# EAGLE design speedometer (EAGLE 9.3.2)
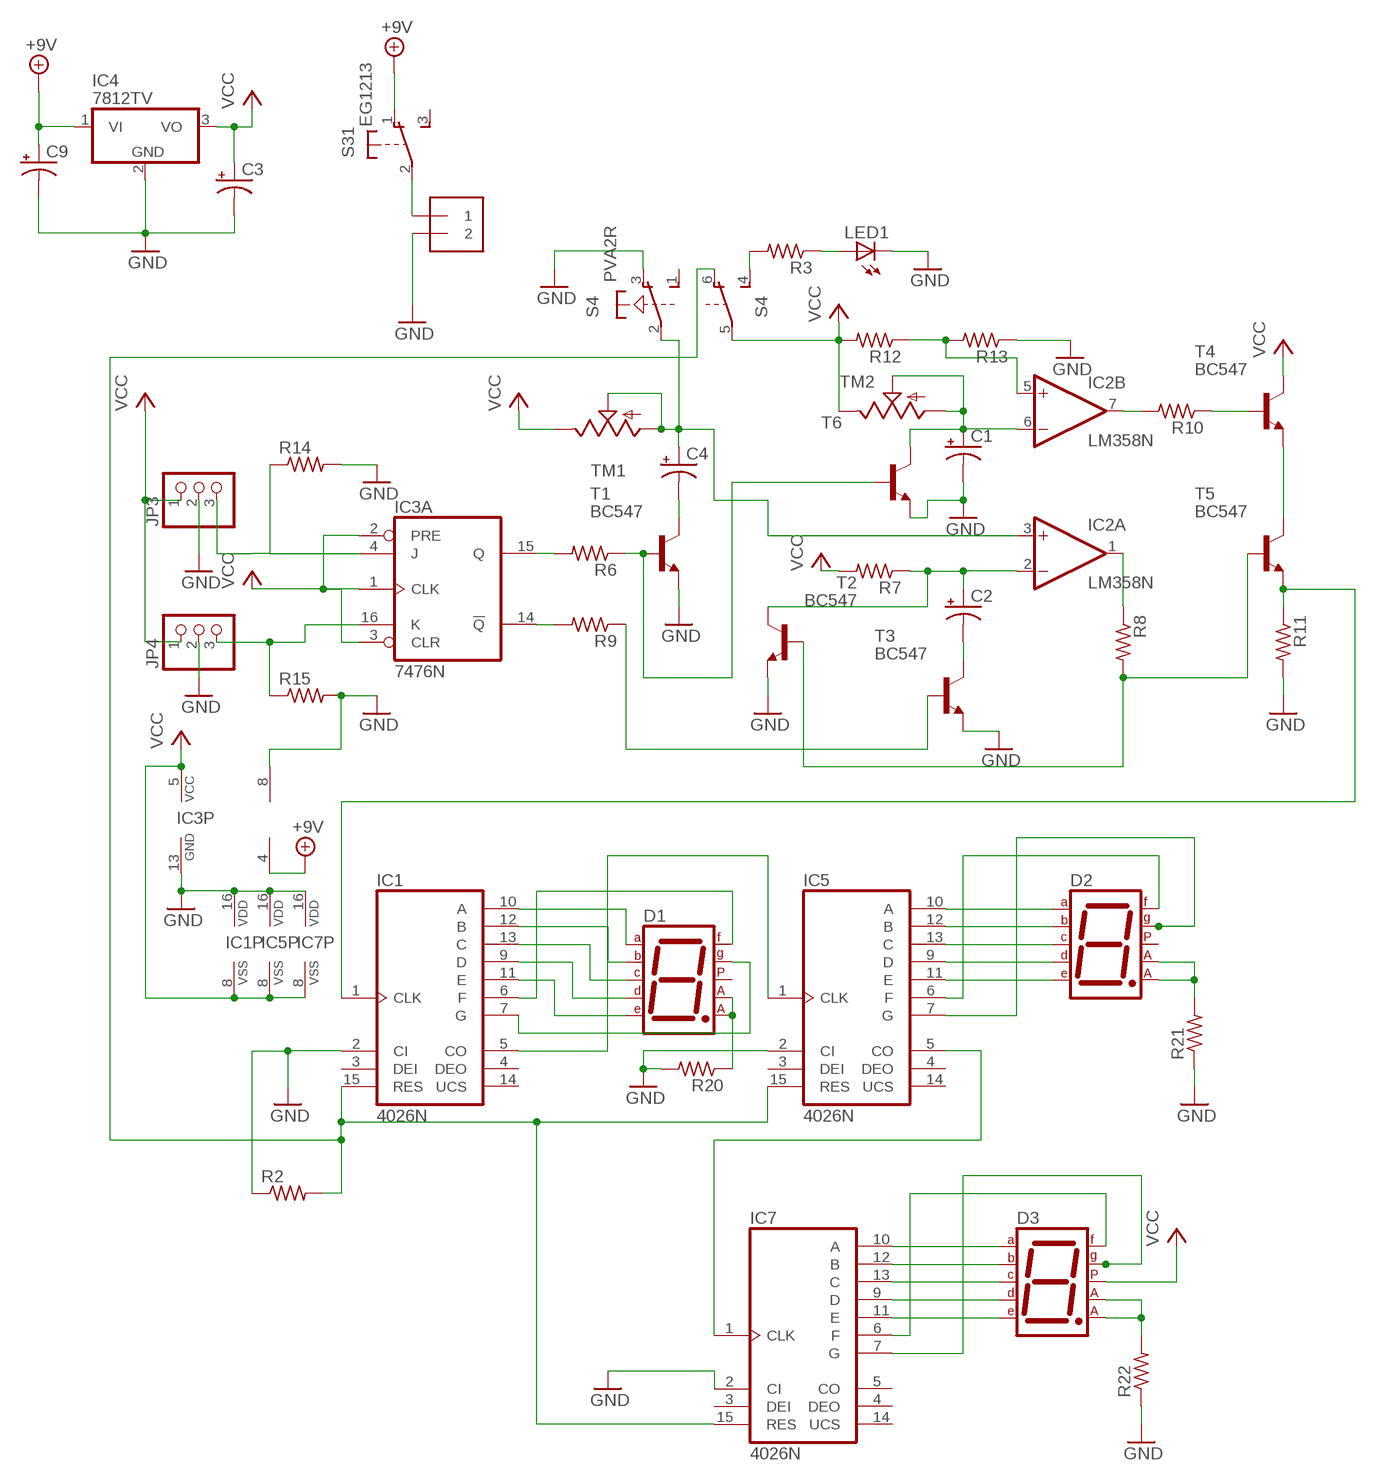
[diagram p0: schematic, sheet 1]

## Parts
C1  CPOL-USE2-4  [E2-4]
C2  CPOL-USE2-4  [E2-4]
C3  CPOL-USE2-4  [E2-4]
C4  CPOL-USE2-4  [E2-4]
C9  CPOL-USE2.5-6  [E2,5-6]
D1  7SEG-CA  [7SEG-13]
D2  7SEG-CA  [7SEG-13]
D3  7SEG-CA  [7SEG-13]
IC1  4026N  [DIL16]
IC2  LM358N  [DIL08]
IC3  7476N  [DIL16]
IC4  7812TV  [TO220V]
IC5  4026N  [DIL16]
IC7  4026N  [DIL16]
J1  1X2-3.5MM  [1X2-3.5MM]
JP3  PINHD-1X3  [1X03]
JP4  PINHD-1X3  [1X03]
LED1  LED5MM  [LED5MM]
R2  R-US_0204/7  [0204/7]
R3  R-US_0204/7  [0204/7]
R6  R-US_0204/7  [0204/7]
R7  R-US_0204/7  [0204/7]
R8  R-US_0204/7  [0204/7]
R9  R-US_0204/7  [0204/7]
R10  R-US_0204/7  [0204/7]
R11  R-US_0204/7  [0204/7]
R12  R-US_0204/7  [0204/7]
R13  R-US_0204/7  [0204/7]
R14  R-US_0204/7  [0204/7]
R15  R-US_0204/7  [0204/7]
R20  R-US_0204/7  [0204/7]
R21  R-US_0204/7  [0204/7]
R22  R-US_0204/7  [0204/7]
S3  EG1213  [EG1213]
S4  PVA2R  [PVA2R]
T1  BC547  [TO92]
T2  BC547  [TO92]
T3  BC547  [TO92]
T4  BC547  [TO92]
T5  BC547  [TO92]
T6  BC547  [TO92]
TM1  TRIM  [6MM]
TM2  TRIM  [6MM]

## Nets
+9V: C9.+ IC2.4(P:V-) IC4.1(VI) S3.1(1:O)
GND: C1.- C3.- C9.- IC1.2(CI) IC1.16(VDD) IC2.8(P:V+) IC3.13(P:GND) IC4.2(GND) IC5.2(CI) IC5.16(VDD) IC7.2(CI) IC7.16(VDD) J1.2 JP3.2 JP4.2 LED1.K(C) R2.1 R11.2 R13.1 R14.2 R15.2 R20.2 R21.1 R22.1 S4.3(1:O) T1.1(E) T2.1(E) T3.1(E) T6.1(E)
N$1: IC3.4(A:J) JP3.3 R14.1
N$2: IC3.16(A:K) JP4.3 R15.1
N$4: R3.2 S4.4(2:S)
N$5: C4.- T1.3(C)
N$6: C4.+ IC2.3(A:+IN) S4.2(1:P) TM1.A TM1.S
N$7: R6.1 T1.2(B) T6.2(B)
N$8: IC1.15(RES) IC5.15(RES) IC7.15(RES) R2.2 S4.6(2:O)
N$9: IC3.15(A:Q) R6.2
N$10: C2.+ IC2.2(A:-IN) R7.1 T2.3(C)
N$11: R8.2 T2.2(B) T5.2(B)
N$12: IC3.14(A:!Q) R9.2
N$13: IC2.1(A:OUT) R8.1
N$14: LED1.A R3.1
N$15: R9.1 T3.2(B)
N$16: C2.- T3.3(C)
N$17: IC2.7(B:OUT) R10.2
N$18: R10.1 T4.2(B)
N$19: T4.1(E) T5.3(C)
N$20: IC2.5(B:+IN) R12.1 R13.2
N$21: C1.+ IC2.6(B:-IN) T6.3(C) TM2.A TM2.S
N$23: D1.7(A) IC1.10(A)
N$24: D1.3(CA1) D1.8(CA2) R20.1
N$27: D1.6(B) IC1.12(B)
N$28: IC1.1(CLK) R11.1 T5.1(E)
N$29: D1.2(D) IC1.9(D)
N$30: D1.4(C) IC1.13(C)
N$32: D1.1(E) IC1.11(E)
N$33: D1.9(F) IC1.6(F)
N$34: D1.10(G) IC1.7(G)
N$35: IC1.5(CO) IC5.1(CLK)
N$36: D2.3(CA1) D2.8(CA2) R21.2
N$37: D2.7(A) IC5.10(A)
N$38: D2.6(B) IC5.12(B)
N$39: D2.4(C) IC5.13(C)
N$40: D2.2(D) IC5.9(D)
N$41: D2.1(E) IC5.11(E)
N$42: D2.9(F) IC5.6(F)
N$45: D2.10(G) IC5.7(G)
N$48: IC5.5(CO) IC7.1(CLK)
N$50: J1.1 S3.2(1:P)
N$52: D3.7(A) IC7.10(A)
N$53: D3.6(B) IC7.12(B)
N$54: D3.4(C) IC7.13(C)
N$55: D3.2(D) IC7.9(D)
N$56: D3.1(E) IC7.11(E)
N$57: D3.9(F) IC7.6(F)
N$58: D3.10(G) IC7.7(G)
N$59: D3.3(CA1) D3.8(CA2) R22.2
VCC: C3.+ D3.5(DP) IC1.8(VSS) IC3.1(A:CLK) IC3.2(A:PRE) IC3.3(A:CLR) IC3.5(P:VCC) IC4.3(VO) IC5.8(VSS) IC7.8(VSS) JP3.1 JP4.1 R7.2 R12.2 S4.5(2:P) T4.3(C) TM1.E TM2.E
Unconnected: D1.5(DP) D2.5(DP) IC1.3(DEI) IC1.4(DEO) IC1.14(UCS) IC3.6(B:CLK) IC3.7(B:PRE) IC3.8(B:CLR) IC3.9(B:J) IC3.10(B:!Q) IC3.11(B:Q) IC3.12(B:K) IC5.3(DEI) IC5.4(DEO) IC5.14(UCS) IC7.3(DEI) IC7.4(DEO) IC7.5(CO) IC7.14(UCS) S3.3(1:S) S3.MT1(MT) S3.MT2(MT) S4.1(1:S)

## Library data of the parts
C1-C4 C9 = adafruit:CPOL-US: POLARIZED CAPACITOR, American symbol
D1-D3 = special:7SEG-CA: 7-segment DISPLAY single anode, 13 mm
IC1 IC5 IC7 = 40xx:4026: Decade COUNTER/DIVIDER, 7-seg. outputs
IC2 = linear:LM358: OP AMP also LM158; LM258; LM2904 Source: http://cache.national.com/ds/LM/LM158.pdf
IC3 = 74xx-eu:74*76: Dual J-K FLIP FLOP, preset and clear
IC4 = linear:78*: Positive VOLTAGE REGULATOR Source: http://cache.national.com/ds/LM/LM78L05.pdf http://www.fairchildsemi.com/ds/LM/LM7805.pdf
J1 = adafruit:1X2: 3.5mm Terminal block http://www.ladyada.net/library/pcb/eaglelibrary.html
JP3 JP4 = adafruit:PINHD-1X3: PIN HEADER
LED1 = adafruit:LED: LED OSRAM: - CHIPLED LG R971, LG N971, LY N971, LG Q971, LY Q971, LO R971, LY R971 LH N974, LH R974 LS Q976, LO Q976, LY Q976 LO Q996 - Hyper CHIPLED LW Q18S LB Q993, LB Q99A, LB R99A - SideLED LS A670, LO A670, LY A670, LG A670, LP A670 LB A673, LV A673, LT A673, LW A673 LH A674 LY A675 LS A676, LA A676, LO A676, LY A676, LW A676 LS A679, LY A679, LG A679 - Hyper Micro SIDELED® LS Y876, LA Y876, LO Y876, LY Y876 LT Y87S - SmartLED LW L88C, LW L88S LB L89C, LB L89S, LG L890 LS L89K, LO L89K, LY L89K LS L896, LA L896, LO L896, LY L896 - TOPLED LS T670, LO T670, LY T670, LG T670, LP T670 LSG T670, LSP T670, LSY T670, LOP T670, LYG T670 LG T671, LOG T671, LSG T671 LB T673, LV T673, LT T673, LW T673 LH T674 LS T676, LA T676, LO T676, LY T676, LB T676, LH T676, LSB T676, LW T676 LB T67C, LV T67C, LT T67C, LS T67K, LO T67K, LY T67K, LW E67C LS E67B, LA E67B, LO E67B, LY E67B, LB E67C, LV E67C, LT E67C LW T67C LS T679, LY T679, LG T679 LS T770, LO T770, LY T770, LG T770, LP T770 LB T773, LV T773, LT T773, LW T773 LH T774 LS E675, LA E675, LY E675, LS T675 LS T776, LA T776, LO T776, LY T776, LB T776 LHGB T686 LT T68C, LB T68C - Hyper Mini TOPLED® LB M676 - Mini TOPLED Santana® LG M470 LS M47K, LO M47K, LY M47K Source: http://www.osram.convergy.de/
R2 R3 R6-R15 R20-R22 = adafruit:R-US_: RESISTOR, American symbol
S3 = adafruit:EG1213: E-Switch right-angle slide SPDT Part #EG1213 http://www.ladyada.net/library/eagle
S4 = switch-misc:PVA2R: ITT SWITCH
T1-T6 = transistor-neu-to92:BC547: NPN TRANSISTOR
TM1 TM2 = adafruit:TRIM

## Board
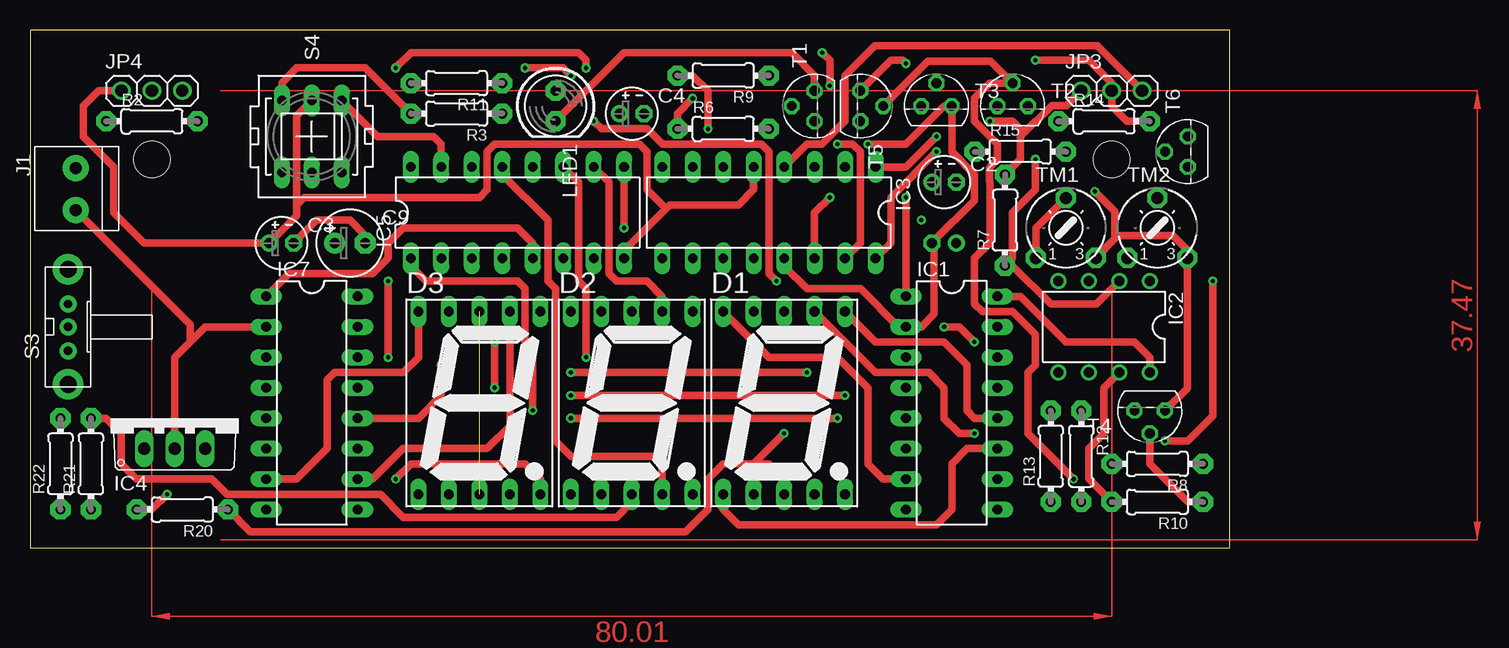
[diagram p1: board, top side]
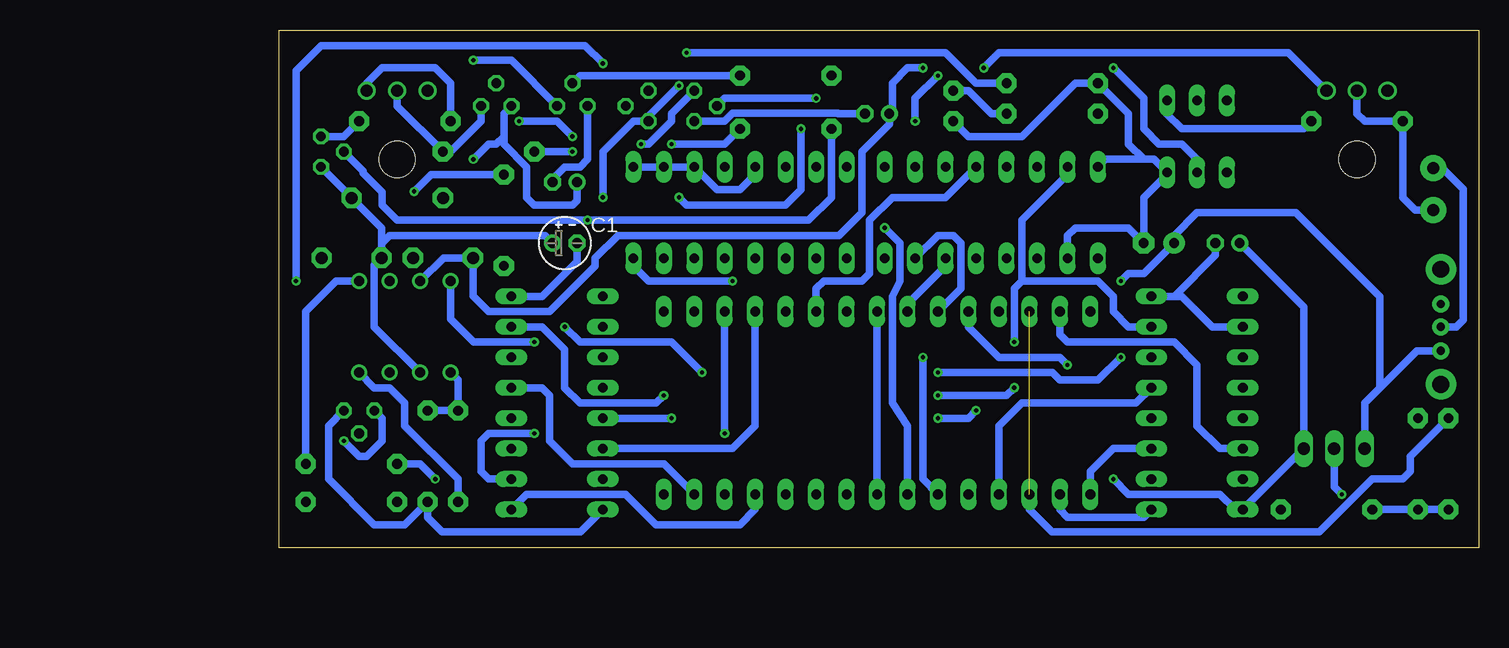
[diagram p2: board, bottom side, seen from below]

Size 100 x 43.17 mm. Coordinates in mm from the lower left corner, seen from the top.
Outline: 0,0 100,0 100,43.17 0,43.17 0,0
Copper layers (1*16): Top 0.035mm / dielectric 1.5mm / Bottom 0.035mm
Design rules "default": minimum track width 6mil, minimum drill 0.35mm, track to track 6mil, track to pad 6mil, pad to pad 6mil, via to via 6mil, smd to smd 6mil, copper to edge 40mil, drill to drill 6mil, minimum pad ring 10mil, minimum via ring 8mil, stop-mask expansion 4mil, vias tented up to drill 0mil, thermal gap 10mil
Holes 3 mm at 10.16,32.38 90.17,32.38

### Footprints (pad centres in the part's own frame; a part is rotated, then mirrored left to right if it is on the bottom)
E2-4 = drill 0.813 pad 1.422: + -1.016,0 | drill 0.813 pad 1.422 octagon: - 1.016,0
E2,5-6 = drill 0.813 pad 1.778: + -1.27,0 | drill 0.813 pad 1.778 octagon: - 1.27,0
7SEG-13 = drill 0.813 long: 1 -5.08,-7.62; 2 -2.54,-7.62; 3 0,-7.62; 4 2.54,-7.62; 5 5.08,-7.62; 6 5.08,7.62; 7 2.54,7.62; 8 0,7.62; 9 -2.54,7.62; 10 -5.08,7.62
DIL16 = drill 0.813 long: 1 -8.89,-3.81; 2 -6.35,-3.81; 3 -3.81,-3.81; 4 -1.27,-3.81; 5 1.27,-3.81; 6 3.81,-3.81; 7 6.35,-3.81; 8 8.89,-3.81; 9 8.89,3.81; 10 6.35,3.81; 11 3.81,3.81; 12 1.27,3.81; 13 -1.27,3.81; 14 -3.81,3.81; 15 -6.35,3.81; 16 -8.89,3.81
DIL08 = drill 0.813 pad 1.27: 1 -3.81,-3.81; 2 -1.27,-3.81; 3 1.27,-3.81; 4 3.81,-3.81; 5 3.81,3.81; 6 1.27,3.81; 7 -1.27,3.81; 8 -3.81,3.81
TO220V = drill 1.016 long: 1 -2.54,-2.54; 2 0,-2.54; 3 2.54,-2.54
1X2-3.5MM = drill 1 pad 2.184: 1 1.8,0; 2 -1.7,0
1X03 = drill 1.016: 1 -2.54,0; 2 0,0; 3 2.54,0
LED5MM = drill 0.813 pad 1.676 octagon: A -1.27,0; K 1.27,0
0204/7 = drill 0.813 pad 1.676 octagon: 1 -3.81,0; 2 3.81,0
EG1213 = drill 0.7 pad 1.422: 1 -2,0; 2 0,0; 3 1.9,0 | drill 1.4 pad 2.54: MT1 -4.8,0; MT2 4.8,0
PVA2R = drill 0.813 long: 1 -2.997,2.489; 2 -2.997,0; 3 -2.997,-2.489; 4 2.997,2.489; 5 2.997,0; 6 2.997,-2.489
TO92 = drill 0.813 octagon: 1 1.27,0; 2 0,1.905; 3 -1.27,0
6MM = drill 1 pad 1.676 octagon: A -2.5,-2.5; E 2.5,-2.5; S 0,2.5

### Placement (x,y rotation side)
C1  76.2,25.4 0 bottom
C2  76.2,30.48 0 top
C3  20.95,25.4 0 top
C4  50.16,36.2 0 top
C9  26.67,25.4 0 top
D1  62.87,12.06 0 top
D2  50.16,12.06 0 top
D3  37.47,12.06 0 top
IC1  76.83,12.06 270 top
IC2  89.53,18.41 180 top
IC3  61.59,27.94 180 top
IC4  12.06,10.79 0 top
IC5  40.64,27.94 0 top
IC7  23.5,12.06 270 top
J1  3.81,29.84 90 top
JP3  90.17,38.1 0 top
JP4  10.16,38.1 0 top
LED1  43.81,36.83 270 top
R2  10.16,35.56 0 top
R3  35.56,36.2 180 top
R6  57.78,34.92 0 top
R7  81.28,27.3 90 top
R8  93.98,6.99 180 top
R9  57.78,39.37 180 top
R10  93.98,3.81 180 top
R11  35.56,38.73 180 top
R12  87.63,7.62 270 top
R13  85.09,7.62 90 top
R14  89.53,35.56 0 top
R15  82.55,33.02 0 top
R20  12.7,3.17 180 top
R21  5.08,6.99 90 top
R22  2.54,6.99 90 top
S3  3.17,18.41 90 top
S4  23.5,34.29 90 top
T1  65.41,36.83 90 top
T2  81.92,36.83 0 top
T3  75.56,36.83 0 top
T4  93.34,11.43 180 top
T5  69.22,36.83 270 top
T6  96.52,33.02 90 top
TM1  86.36,26.67 0 top
TM2  93.98,26.67 0 top

### Tracks (layer width: path | path; a pad name or v marks a point on that pad's centre or on a via)
+9V  (via drill 0.35)
  Top 0.61: v78.74,17.14 77.47,18.41 v76.2,18.41 | v64.77,14.61 v45.09,14.61 | v29.84,15.88 v29.84,22.23
  Bottom 0.61: S3.1 5.17,16.41 8.26,13.34 | IC4.1 9.53,12.06 8.26,13.34 | 8.26,13.34 8.26,20.95 15.24,27.94 23.5,27.94 25.4,26.04 C9.+ 27.94,22.86 29.21,22.86 v29.84,22.23 | IC2.4 85.72,19.05 83.82,17.14 v78.74,17.14 | v76.2,18.41 74.93,17.14 67.31,17.14 v64.77,14.61 | v45.09,14.61 35.56,14.61 34.92,13.97 31.75,13.97 v29.84,15.88
GND  (via drill 0.35)
  Top 0.61: C1.- 75.37,25.59 | 75.37,25.59 78.74,28.96 78.74,31.11 76.83,33.02 T3.1 76.2,36.83 73.03,33.66 v69.85,33.66 | R14.2 91.44,35.56 90.17,36.83 JP3.2 90.17,38.73 88.27,40.64 v83.82,40.64 | IC1.16 82.55,20.95 86.36,17.14 92.08,17.14 93.34,15.88 IC2.8 | 75.37,25.59 75.37,19.49 74.3,18.41 IC1.2 72.39,18.41 69.22,21.59 64.77,21.59 62.87,23.5 IC3.13 | LED1.K 49.53,41.27 63.5,41.27 65.41,39.37 T1.1 | IC4.2 12.06,15.88 13.34,17.14 | 13.34,17.14 14.61,18.41 IC7.2 | J1.2 13.34,18.62 13.34,17.14 | v11.43,4.45 10.16,3.17 R20.2 | C3.- 23.88,27.3 26.67,27.3 27.94,26.04 C9.-
  Bottom 0.61: R13.1 85.09,5.71 89.53,10.16 89.53,12.06 90.81,13.34 92.08,13.34 IC2.8 | R14.2 94.61,34.29 T6.1 | T2.1 83.19,35.56 85.72,33.02 R15.2 90.17,36.83 JP3.2 | T3.1 80.64,40.64 v83.82,40.64 | T1.1 67.31,36.2 67.31,35.56 69.22,33.66 v69.85,33.66 | C1.- 75.18,23.88 78.11,20.95 IC1.16 | IC5.2 34.29,26.04 33.66,26.67 29.21,26.67 C9.- 27.94,29.21 25.98,31.17 S4.3 27.08,32.38 27.94,32.38 | 27.94,32.38 31.11,32.38 IC5.16 | 27.94,32.38 29.21,33.66 29.21,36.2 R11.2 33.66,38.73 38.1,34.29 42.55,34.29 LED1.K | JP4.2 10.16,36.2 9.53,35.56 R2.1 6.35,29.21 5.29,28.14 J1.2 | R22.1 R21.1 R20.2 | IC7.2 22.23,18.41 24.77,20.95 25.4,20.95 | 25.4,20.95 IC7.16 | C3.- 21.97,24.38 25.4,20.95 | IC4.2 12.06,5.08 v11.43,4.45
N$1
  Top 0.61: IC3.4 64.77,33.66 66.04,33.66 67.94,35.56 67.94,39.37 70.42,41.85 88.96,41.85 JP3.3
  Bottom 0.61: R14.1 85.72,38.73 87,40.01 91.44,40.01 92.71,38.73 JP3.3
N$2  (via drill 0.35)
  Top 0.61: v75.56,33.02 71.75,29.21 71.75,25.4 IC3.16 | v41.27,40.01 44.45,40.01 v45.09,39.37 | v46.99,35.56 47.62,34.92 51.44,34.92 52.73,33.63 54.51,33.63 54.54,33.66 60.96,33.66 61.59,33.02 61.59,26.04 61.59,25.4 61.59,22.86 v62.23,22.23
  Bottom 0.61: R15.1 v75.56,33.02 | JP4.3 15.88,41.27 40.01,41.27 v41.27,40.01 | v45.09,39.37 46.99,37.47 v46.99,35.56 | v62.23,22.23 69.22,22.23 70.48,23.5 IC3.16
N$4
  Top 0.61: S4.4 21.01,38.79 22.23,40.01 27.94,40.01 R3.2
N$5
  Bottom 0.61: C4.- 53.41,36.2 53.44,36.22 62.2,36.22 62.87,35.56 T1.3
N$6  (via drill 0.35)
  Top 0.61: TM1.S 83.86,26.67 TM1.A | v46.35,40.01 46.35,40.64 45.72,41.27 31.75,41.27 v30.48,40.01
  Bottom 0.61: IC2.3 86.32,24.17 TM1.A 83.86,21 82.55,19.68 77.47,19.68 73.66,23.5 73.66,24.13 71.75,26.04 53.34,26.04 51.44,27.94 51.44,33.02 49.15,35.31 C4.+ 48.9,36.45 48.9,38.73 47.62,40.01 v46.35,40.01 | v30.48,40.01 27.94,37.47 27.94,34.92 26.67,33.66 24.77,33.66 23.5,32.38 S4.2
N$7  (via drill 0.35)
  Top 0.61: R6.1 53.98,36.2 v55.24,37.47
  Bottom 0.61: T6.2 92.99,31.39 92.99,31.22 91.44,29.67 91.44,28.57 90.17,27.3 v74.3,27.3 55.88,27.3 53.98,29.21 R6.1 | T1.2 62.87,37.47 v55.24,37.47
N$8  (via drill 0.35)
  Top 0.61: v38.73,17.14 v38.73,13.34 | v45.09,12.7 v67.94,12.7 | S4.6 28.98,34.29 33.66,34.29 34.29,33.66 IC5.15
  Bottom 0.61: IC5.15 34.29,31.11 38.1,27.3 38.1,22.23 | 38.1,22.23 38.73,21.59 v38.73,17.14 | v38.73,13.34 39.37,12.7 v45.09,12.7 | v67.94,12.7 68.58,12.06 74.93,12.06 76.2,13.34 76.2,16.51 78.11,18.41 IC1.15 | IC7.15 29.21,18.41 30.48,19.68 30.48,20.95 31.75,22.23 38.1,22.23 | R2.2 14.61,34.92 24.77,34.92 26.04,36.2 25.98,36.25 S4.6
N$9  (via drill 0.35)
  Top 0.61: v67.31,33.66 68.58,33.66 69.22,33.02 69.22,25.4 IC3.15
  Bottom 0.61: R6.2 62.87,33.66 v67.31,33.66
N$10  (via drill 0.35)
  Top 0.61: v83.82,32.38 83.82,29.84 81.92,27.94 81.92,24.13 R7.1 81.92,23.5 85.09,20.32 88.9,20.32 IC2.2
  Bottom 0.61: C2.+ 75.18,28.96 75.56,28.57 78.74,28.57 79.38,29.21 79.38,31.75 81.28,33.66 81.28,34.29 | T2.3 81.28,36.2 81.28,34.29 | v83.82,32.38 82.55,33.66 81.92,33.66 81.28,34.29
N$11  (via drill 0.35)
  Top 0.61: T5.2 74.87,40.58 80.07,40.58 T2.2 80.01,38.73 78.74,37.47 78.74,35.56 80.64,33.66 80.64,32.38 80.01,31.75 80.01,31.68 79.98,31.65 79.98,30.58 80.01,30.55 80.01,25.4 78.74,24.13 78.74,20.32 79.38,19.68 81.92,19.68 83.82,17.78 83.82,15.24 83.19,14.61 83.19,9.53 v87,5.71
  Bottom 0.61: R8.2 88.27,6.99 v87,5.71
N$12  (via drill 0.35)
  Top 0.61: R9.2 55.24,39.37 56.52,38.1 v56.52,34.92 | v66.67,29.21 65.41,27.94 IC3.14
  Bottom 0.61: v56.52,34.92 56.52,29.84 57.78,28.57 66.04,28.57 v66.67,29.21
N$13
  Bottom 0.61: IC2.1 95.25,22.23 97.79,19.68 R8.1
N$14
  Bottom 0.61: R3.1 40.64,36.2 42.55,38.1 LED1.A
N$15
  Bottom 0.61: T3.2 74.93,39.37 R9.1
N$16
  Bottom 0.61: C2.- 77.22,30.73 76.2,31.75 74.93,31.75 74.3,32.38 T3.3
N$17
  Top 0.61: IC2.7 89.53,13.34 89.53,9.53 88.27,8.26 88.27,5.71 R10.2
N$18
  Top 0.61: T4.2 93.34,6.99 96.52,3.81 R10.1
N$19  (via drill 0.35)
  Top 0.61: T5.3 71.75,40.64 72.76,40.64 v73.03,40.38 | v98.61,22.23 98.61,10.98 96.52,8.89 v94.61,8.89
  Bottom 0.61: v73.03,40.38 74.5,41.85 96.52,41.85 98.61,39.76 v98.61,22.23 | v94.61,8.89 93.34,7.62 92.71,7.62 91.44,8.89 91.44,10.79 T4.1
N$20
  Bottom 0.61: R13.2 85.09,12.06 | 85.09,12.06 85.09,13.97 IC2.5 | R12.1 85.72,11.43 85.09,12.06
N$21
  Bottom 0.61: C1.+ 77.85,26.04 90.81,26.04 91.48,25.36 | 91.48,25.36 TM2.A 92.08,23.57 92.08,18.41 IC2.6 | 91.48,25.36 91.48,26.67 TM2.S 93.98,29.21 T6.3
N$23  (via drill 0.35)
  Top 0.61: D1.7 70.48,14.61 74.93,14.61 76.2,13.34 76.2,10.79 77.47,9.53 v78.74,9.53
  Bottom 0.61: v78.74,9.53 82.55,9.53 83.19,8.89 83.19,6.35 82.55,5.71 IC1.10
N$24  (via drill 0.35)
  Top 0.61: R20.1 18.36,1.32 54.66,1.32 56.52,3.17 56.52,5.71 57.78,6.99 60.33,6.99 | 60.33,6.99 61.59,6.99 62.87,5.71 D1.3 | 60.33,6.99 v62.87,9.53
  Bottom 0.61: v62.87,9.53 D1.8
N$27
  Top 0.61: D1.6 70.48,17.14 76.2,17.14 78.11,15.24 78.11,11.43 78.74,10.79 IC1.12
N$28  (via drill 0.35)
  Top 0.61: v73.03,29.21 IC1.1 | v66.67,38.53 66.67,40.64 v66.04,41.27
  Bottom 0.61: v73.03,29.21 73.03,33.02 70.48,35.56 T5.1 69.22,35.99 v66.67,38.53 | R11.1 41.91,38.73 44.45,41.27 v66.04,41.27
N$29
  Bottom 0.61: IC1.9 79.38,4.45 71.12,4.45 68.58,1.91 61.59,1.91 60.33,3.17 D1.2
N$30
  Bottom 0.61: D1.4 67.94,6.99 75.56,6.99 77.47,8.89 77.47,12.7 78.11,13.34 IC1.13
N$32
  Top 0.61: D1.1 57.78,3.17 59.05,1.91 75.56,1.91 76.83,3.17 76.83,6.99 78.11,8.26 IC1.11
N$33
  Bottom 0.61: D1.9 60.33,10.16 62.23,8.26 IC1.6
N$34
  Top 0.61: D1.10 61.59,15.88 67.31,15.88 69.85,13.34 69.85,6.99 71.12,5.71 IC1.7
N$35  (via drill 0.35)
  Top 0.61: v67.31,10.79 v45.09,10.79 | v41.91,11.43 41.91,15.88 41.27,16.51 41.27,21.59 40.64,22.23 33.02,22.23 31.75,23.5 IC5.1
  Bottom 0.61: IC1.5 v67.31,10.79 | v45.09,10.79 42.55,10.79 v41.91,11.43
N$36
  Top 0.61: R21.2 6.35,10.79 7.62,9.53 7.62,6.99 8.87,5.74 15.14,5.74 16.44,4.45 29.21,4.45 31.11,2.54 48.9,2.54 50.16,3.81 D2.3
  Bottom 0.61: D2.8 D2.3
N$37
  Top 0.61: IC5.10 48.26,30.48 48.26,22.86 48.9,22.23 51.44,22.23 52.7,20.95 D2.7
N$38
  Bottom 0.61: IC5.12 44.45,29.21 48.9,29.21 50.8,27.3 50.8,22.86 51.44,22.23 54.61,22.23 55.24,21.59 D2.6
N$39
  Top 0.61: D2.4 52.7,6.99 52.07,7.62 45.09,7.62 43.81,8.89 43.81,21.59 43.18,22.23 43.18,27.3 39.37,31.11 IC5.13
N$40  (via drill 0.35)
  Top 0.61: IC5.9 v49.53,26.67
  Bottom 0.61: v49.53,26.67 48.26,25.4 48.26,22.23 48.9,20.95 48.9,12.06 47.62,10.16 D2.2
N$41  (via drill 0.35)
  Top 0.61: IC5.11 45.72,30.48 45.72,22.23 46.35,21.59 v46.35,15.88
  Bottom 0.61: v46.35,15.88 46.35,5.71 D2.1
N$42
  Bottom 0.61: IC5.6 44.45,23.5 47.62,20.32 D2.9
N$45
  Bottom 0.61: IC5.7 45.09,26.04 43.81,26.04 43.18,25.4 43.18,21.59 D2.10
N$48
  Top 0.61: IC7.1 21.59,22.86 28.57,22.86 29.84,24.13 29.84,25.4 31.11,26.67 40.64,26.67 41.91,25.4 IC5.5
N$50
  Bottom 0.61: J1.1 3.07,31.64 1.32,29.9 1.32,19 1.91,18.41 S3.2
N$52
  Top 0.61: IC7.10 28.57,5.71 31.11,8.26 38.1,8.26 40.01,10.16 D3.7
N$53  (via drill 0.35)
  Top 0.61: IC7.12 32.38,10.79 34.29,12.7 v34.29,15.24
  Bottom 0.61: v34.29,15.24 34.92,15.88 40.01,15.88 42.55,18.41 D3.6
N$54
  Bottom 0.61: D3.4 40.01,10.16 38.1,12.06 28.57,12.06 IC7.13
N$55
  Bottom 0.61: IC7.9 27.94,2.54 34.29,2.54 34.92,3.17 D3.2
N$56
  Bottom 0.61: D3.1 32.38,6.35 30.48,8.26 IC7.11
N$57
  Bottom 0.61: IC7.6 21.59,8.26 23.5,10.16 23.5,15.24 25.4,17.14 34.29,17.14 34.92,17.78 D3.9
N$58
  Top 0.61: IC7.7 22.23,5.71 24.77,8.26 24.77,13.97 25.4,14.61 31.11,14.61 32.38,15.88 D3.10
N$59  (1 unrouted)
  Bottom 0.61: R22.2 5.71,7.62 5.71,6.35 6.35,5.71 8.89,5.71 13.28,1.32 35.61,1.32 37.47,3.17 D3.3
VCC  (via drill 0.35)
  Top 0.61: T4.3 96.48,13.29 TM2.E 96.48,24.8 95.25,26.04 90.72,26.04 90.45,25.76 | TM1.E 90.45,25.76 | v88.76,29.7 90.45,28.02 90.45,25.76 | JP3.1 86.39,36.85 85.19,36.85 83.89,35.56 83.82,35.56 82.87,34.61 | 82.87,34.61 82.55,34.29 82.55,32.38 R7.2 | 82.87,34.61 81.92,35.56 v80.01,35.56 | v75.56,34.29 73.03,31.75 IC3.1 | 53.02,28.26 53.34,28.57 59.05,28.57 60.33,29.84 IC3.5 | 53.02,28.26 49.53,24.77 IC5.8 | S4.5 22.23,36.02 22.23,28.57 | 22.23,28.57 22.23,27.69 C3.+ 9.53,25.4 6.99,27.94 6.99,31.75 4.45,34.29 4.45,36.83 5.71,38.1 JP4.1 | 53.02,28.26 51.44,29.84 51.44,33.02 50.8,33.66 38.73,33.66 38.1,33.02 38.1,29.84 37.47,29.21 22.86,29.21 22.23,28.57 | v30.48,5.71 31.75,6.99 41.27,6.99 42.55,5.71 D3.5
  Bottom 0.61: T4.3 95.89,10.16 95.89,5.71 92.08,1.91 89.53,1.91 R12.2 87.63,2.54 86.41,1.32 74.88,1.32 IC1.8 | R7.2 87.35,31.11 v88.76,29.7 | IC3.1 IC3.2 IC3.3 63.5,29.84 61.59,29.84 60.33,31.11 IC3.5 | v80.01,35.56 76.83,35.56 v75.56,34.29 | C3.+ 14.61,20.07 IC4.3 IC7.8 20.32,3.17 21.59,4.45 29.21,4.45 v30.48,5.71
(copper drawn outside any net)
  shapes: Top area x2